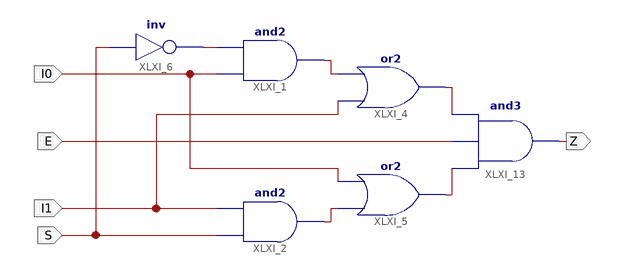
[diagram p0: schematic sheet 1]
// Xilinx ISE schematic circuit.sch (spartan3e) as structural Verilog: 6 symbols, 5 ports
module circuit (
  input  S,
  input  I1,
  input  I0,
  input  E,
  output Z
);

  wire XLXN_1, XLXN_2, XLXN_3, XLXN_19, XLXN_20;

  and XLXI_1 (XLXN_1, I0, XLXN_3);
  and XLXI_2 (XLXN_2, S, I1);
  or XLXI_4 (XLXN_19, I1, XLXN_1);
  or XLXI_5 (XLXN_20, XLXN_2, I0);
  not XLXI_6 (XLXN_3, S);
  and XLXI_13 (Z, XLXN_20, E, XLXN_19);
endmodule
